# Altium schematic sheet 05.SchDoc
size 297 x 209 mm
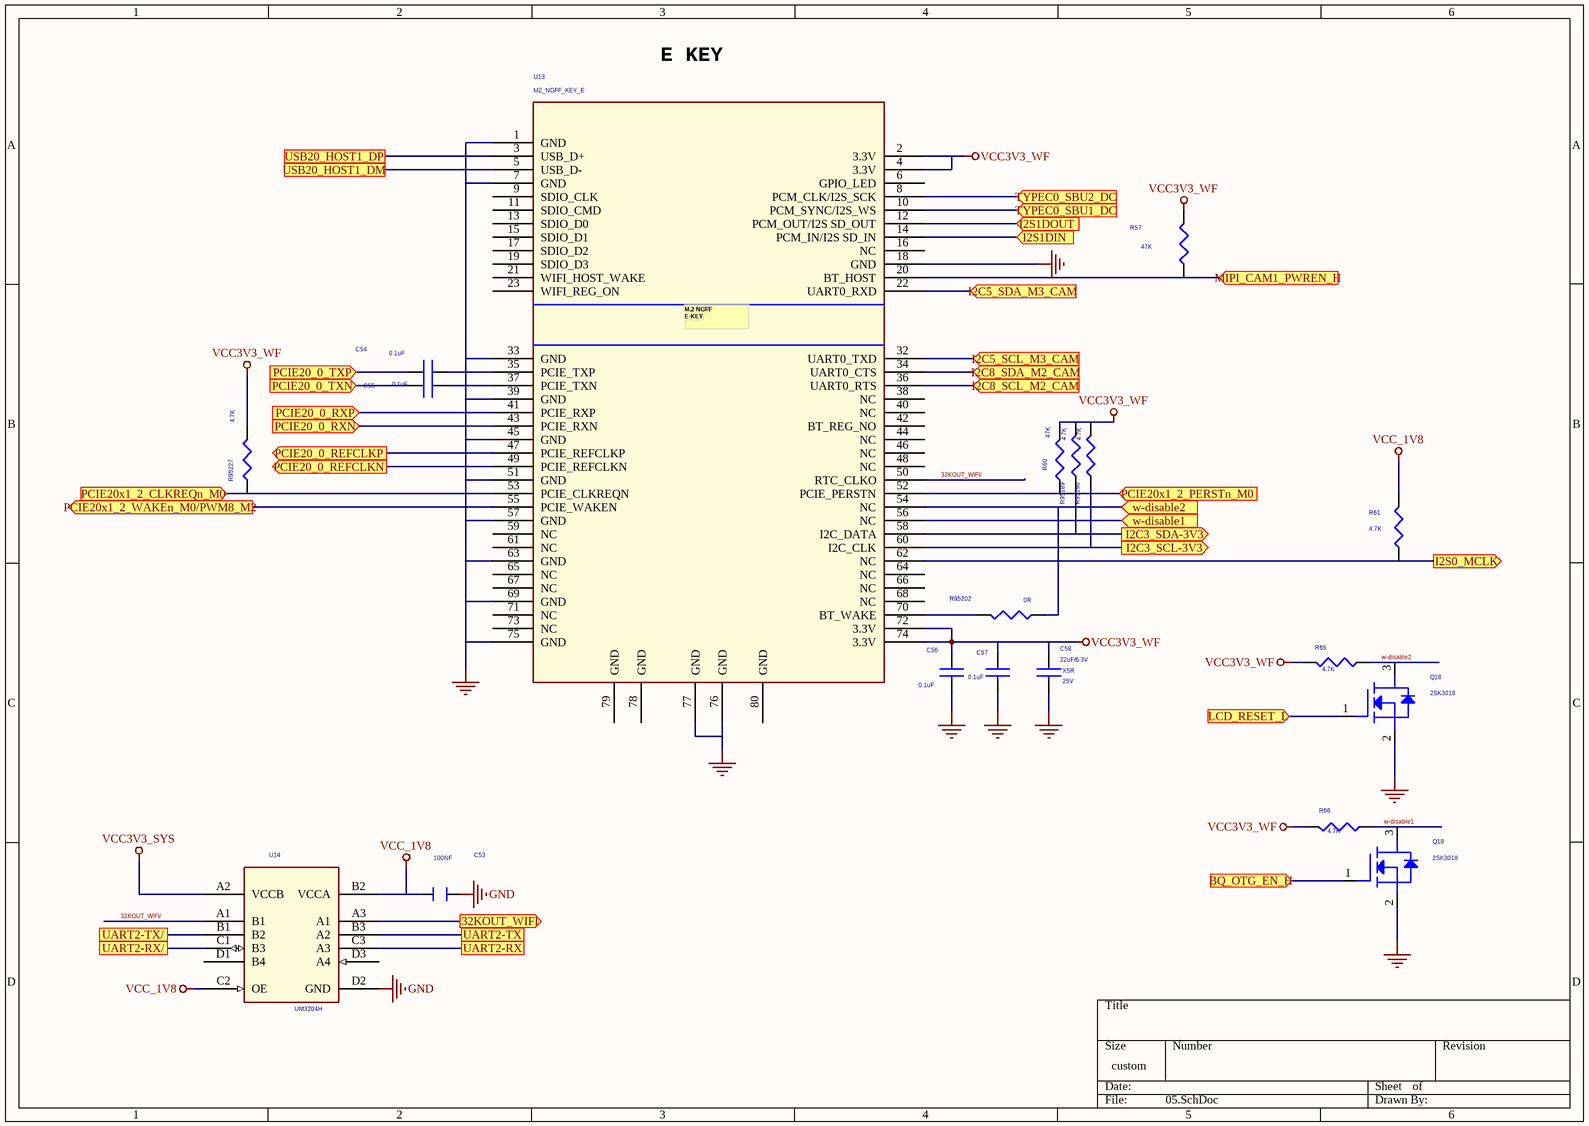
[diagram p0: 05.SchDoc]

## Parts
C53  100NF  [C0402]
C54  0.1uF  [C0603]
C55  0.1uF  [C0603]
C56  0.1uF  [C0402]
C57  0.1uF  [C0402]
C58  22uF/6.3V  Dielectric: X5R  Voltage: 25V  [C0805]
Q18  2SK3018  [SOT23]
Q19  2SK3018  [SOT23]
R57  47K  [R0402]
R60  47K  [R0402]
R61  4.7K  [R0402]
R65  4.7K  [R0402]
R66  4.7K  [R0402]
R95189  4.7K  [R0402]
R95190  4.7K  [R0402]
R95202  0R  [R0402]
R95227  4.7K  [R0402]
U13  M2_NGFF_KEY_E  [M2_NGFF_KEY_E_1]
U14  UM3204H  [CSP-12]

## Ports
32KOUT_WIFI (out), BQ_OTG_EN_H (in), I2C3_SCL-3V3 (out), I2C3_SDA-3V3 (out), I2C5_SCL_M3_CAM (in), I2C5_SDA_M3_CAM (in), I2C8_SCL_M2_CAM (in), I2C8_SDA_M2_CAM (in), I2S0_MCLK (out), I2S1DIN (in), I2S1DOUT (in), LCD_RESET_L (in), MIPI_CAM1_PWREN_H (in), PCIE20_0_REFCLKN (out), PCIE20_0_REFCLKP (out), PCIE20_0_RXN (in), PCIE20_0_RXP (in), PCIE20_0_TXN (in), PCIE20_0_TXP (in), PCIE20x1_2_CLKREQn_M0 (in), PCIE20x1_2_PERSTn_M0 (in), PCIE20x1_2_WAKEn_M0/PWM8_M2 (out), TYPEC0_SBU1_DC (in), TYPEC0_SBU2_DC (in), UART2-RX, UART2-RX/, UART2-TX, UART2-TX/, USB20_HOST1_DM, USB20_HOST1_DP, w-disable1 (in), w-disable2 (in)

## Nets
GND: C53.1 C56.2 C57.2 C58.2 Q18.2(SOURCE) Q19.2(SOURCE) U13.1(GND) U13.7(GND) U13.18(GND) U13.33(GND) U13.39(GND) U13.45(GND) U13.51(GND) U13.57(GND) U13.63(GND) U13.69(GND) U13.75(GND) U13.76(GND) U13.77(GND) U14.D2(GND)
VCC3V3_SYS: U14.A2(VCCB)
VCC3V3_WF: C56.1 C57.1 C58.1 R57.2 R60.2 R65.2 R66.2 R95189.2 R95190.2 R95227.2 U13.2(3.3V) U13.4(3.3V) U13.72(3.3V) U13.74(3.3V)
VCC_1V8: C53.2 R61.2 U14.B2(VCCA) U14.C2(OE)
32KOUT_WIFI: U14.A3(A1) ; port 32KOUT_WIFI
32KOUT_WIFI/: U13.50(RTC_CLKO) U14.A1(B1)
BQ_OTG_EN_H: Q19.1(GATE) ; port BQ_OTG_EN_H
I2C3_SCL-3V3: R95190.1 U13.60(I2C_CLK) ; port I2C3_SCL-3V3
I2C3_SDA-3V3: R95189.1 U13.58(I2C_DATA) ; port I2C3_SDA-3V3
I2C5_SCL_M3_CAM: U13.32(UART0_TXD) ; port I2C5_SCL_M3_CAM
I2C5_SDA_M3_CAM: U13.22(UART0_RXD) ; port I2C5_SDA_M3_CAM
I2C8_SCL_M2_CAM: U13.36(UART0_RTS) ; port I2C8_SCL_M2_CAM
I2C8_SDA_M2_CAM: U13.34(UART0_CTS) ; port I2C8_SDA_M2_CAM
I2S0_MCLK: R61.1 U13.62(NC) ; port I2S0_MCLK
I2S1DIN: U13.14(PCM_IN/I2S_SD_IN) ; port I2S1DIN
I2S1DOUT: U13.12(PCM_OUT/I2S_SD_OUT) ; port I2S1DOUT
LCD_RESET_L: Q18.1(GATE) ; port LCD_RESET_L
MIPI_CAM1_PWREN_H: R57.1 U13.20(BT_HOST) ; port MIPI_CAM1_PWREN_H
PCIE20_0_REFCLKN: U13.49(PCIE_REFCLKN) ; port PCIE20_0_REFCLKN
PCIE20_0_REFCLKP: U13.47(PCIE_REFCLKP) ; port PCIE20_0_REFCLKP
PCIE20_0_RXN: U13.43(PCIE_RXN) ; port PCIE20_0_RXN
PCIE20_0_RXP: U13.41(PCIE_RXP) ; port PCIE20_0_RXP
PCIE20_0_TXN: C55.2 ; port PCIE20_0_TXN
PCIE20_0_TXP: C54.2 ; port PCIE20_0_TXP
PCIE20x1_2_CLKREQn_M0: R95227.1 U13.53(PCIE_CLKREQN) ; port PCIE20x1_2_CLKREQn_M0
PCIE20x1_2_PERSTn_M0: R60.1 U13.52(PCIE_PERSTN) ; port PCIE20x1_2_PERSTn_M0
PCIE20x1_2_WAKEn_M0/PWM8_M2: U13.55(PCIE_WAKEN) ; port PCIE20x1_2_WAKEn_M0/PWM8_M2
TYPEC0_SBU1_DC: U13.10(PCM_SYNC/I2S_WS) ; port TYPEC0_SBU1_DC
TYPEC0_SBU2_DC: U13.8(PCM_CLK/I2S_SCK) ; port TYPEC0_SBU2_DC
UART2-RX: U14.C3(A3) ; port UART2-RX
UART2-RX/: U14.C1(B3) ; port UART2-RX/
UART2-TX: U14.B3(A2) ; port UART2-TX
UART2-TX/: U14.B1(B2) ; port UART2-TX/
USB20_HOST1_DM: U13.5(USB_D-) ; port USB20_HOST1_DM
USB20_HOST1_DP: U13.3(USB_D+) ; port USB20_HOST1_DP
w-disable1: U13.56(NC) ; port w-disable1
w-disable1: Q19.3(DRAIN) R66.1  [a separate net that carries the same name]
w-disable2: R95202.1 U13.54(NC) ; port w-disable2
w-disable2: Q18.3(DRAIN) R65.1  [a separate net that carries the same name]
NetC54_1: C54.1 U13.35(PCIE_TXP)
NetC55_1: C55.1 U13.37(PCIE_TXN)
NetR95202_2: R95202.2 U13.70(BT_WAKE)

Not connected (* = marked no-connect by the designer): U13 6(GPIO_LED) 9(SDIO_CLK) 11(SDIO_CMD) 13(SDIO_D0) 15(SDIO_D1) 16(NC) 17(SDIO_D2) 19(SDIO_D3) 21(WIFI_HOST_WAKE) 23(WIFI_REG_ON) 38(NC) 40(NC) 42(BT_REG_NO) 44(NC) 46(NC) 48(NC) 59(NC) 61(NC) 64(NC) 65(NC) 66(NC) 67(NC) 68(NC) 71(NC) 73(NC) 78(GND) 79(GND) 80(GND); U14 D1(B4) D3(A4)

## Notes on the sheet
- E KEY
- (in symbol M_4.2 NGFF EKEY SOCKET) M.2 NGFF / E-KEY

## Library data of the parts
C53 = CAPACITOR_0: PAGE: 1
C54 C55 = CAP NP_Dup3: RoHS CHIP CAP 1uF +10/-10% 16V X5R
C56 C57 = CAP NP_2: cap,100.00nF,+/-10%,6.3V,X5R,C0402; Manufacturer PN: C1005X5R0J104K050BA; Manufacturer: TDK; Voltage: 16V; Tolerance: 10%; Priority: A; Dielectric: X5R; Created by: JJJ; Part Type: C0402; RK PN: C1005X5R0J104K050BA
C58 = CAP NP_2: cap,4.70uF,+/-10%,6.3V,X5R,C0603; Manufacturer: TDK; RK PN: C1608X5R0J475K080AB; Priority: A; Tolerance: 10%; Part Type: C0603; Manufacturer PN: C1608X5R0J475K080AB; Created by: JJJ
Q18 Q19 = MOSFET N_Dup1: NMOS,2SK3018,SOT_323,Id=0.1A,Vds=30V; Manufacturer: ROHM; Priority: A; Id_max: 0.1A; Vgs: 20V; VDS: 30V; Vgsth: 1.5V; Pd: 0.2W; Rds: 5ohm; RK PN: 2SK3018; Part Type: NMOS; Manufacturer PN: 2SK3018; Created by: JJJ
R57 R60 R61 R65 R66 R95189 R95190 R95202 R95227 = R_2
U13 = M_4.2 NGFF EKEY SOCKET
U14 = MP2610_0: 4-bit Bi-directional Level Shifter UM3204H; Part Number: PI4ULS5V104GAEX; Vendor: PERICOM